# Altium schematic sheet controller.SchDoc
size Letter
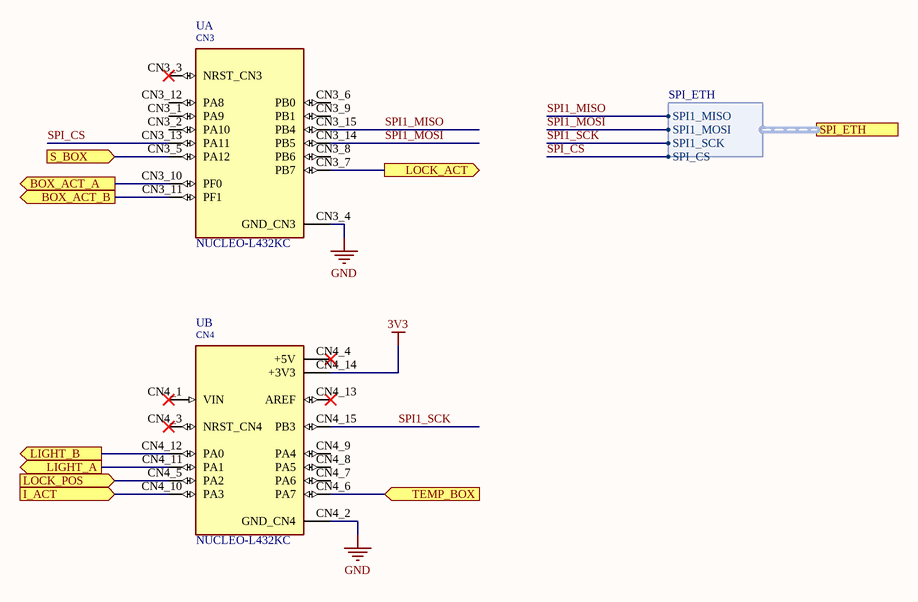
[diagram p0: controller.SchDoc]

## Parts
U  NUCLEO-L432KC  [MODULE_NUCLEO-L432KC]  (parts A,B of 2)

## Ports
BOX_ACT_A (out), BOX_ACT_B (out), I_ACT (in), LIGHT_A (out), LIGHT_B (out), LOCK_ACT (out), LOCK_POS (in), S_BOX (in), SPI_ETH (harness SPI_ETH), TEMP_BOX (in)

## Harnesses
SPI_ETH: SPI1_MISO, SPI1_MOSI, SPI1_SCK, SPI_CS

## Nets
3V3: U.CN4_14(+3V3)
GND: U.CN3_4(GND_CN3) U.CN4_2(GND_CN4)
BOX_ACT_A: U.CN3_10(PF0) ; port BOX_ACT_A
BOX_ACT_B: U.CN3_11(PF1) ; port BOX_ACT_B
I_ACT: U.CN4_10(PA3) ; port I_ACT
LIGHT_A: U.CN4_11(PA1) ; port LIGHT_A
LIGHT_B: U.CN4_12(PA0) ; port LIGHT_B
LOCK_ACT: U.CN3_7(PB7) ; port LOCK_ACT
LOCK_POS: U.CN4_5(PA2) ; port LOCK_POS
S_BOX: U.CN3_5(PA12) ; port S_BOX
SPI1_MISO: U.CN3_15(PB4) ; port SPI_ETH.SPI1_MISO
SPI1_MOSI: U.CN3_14(PB5) ; port SPI_ETH.SPI1_MOSI
SPI1_SCK: U.CN4_15(PB3) ; port SPI_ETH.SPI1_SCK
SPI_CS: U.CN3_13(PA11) ; port SPI_ETH.SPI_CS
TEMP_BOX: U.CN4_6(PA7) ; port TEMP_BOX

Not connected (* = marked no-connect by the designer): U CN3_1(PA9) CN3_2(PA10) CN3_3(NRST_CN3)* CN3_6(PB0) CN3_8(PB6) CN3_9(PB1) CN3_12(PA8) CN4_1(VIN)* CN4_3(NRST_CN4)* CN4_4(+5V)* CN4_7(PA6) CN4_8(PA5) CN4_9(PA4) CN4_13(AREF)*

## Notes on the sheet
- Title
- Size:
- Date:
- Letter
- Number:
- Time:
- Revision:
- Sheet
- of
- File:
- (in symbol NUCLEO-L432KC, part A) CN3
- (in symbol NUCLEO-L432KC, part B) CN4

## Library data of the parts
U = NUCLEO-L432KC: STM32L432KC, mbed-Enabled Development Nucleo-32 STM32L4 ARMÂ® CortexÂ®-M4 MCU 32-Bit Embedded Evaluation Board; MF: STMicroelectronics; Price: None; Value: *; Package: None; Availability: Unavailable; SnapEDA_Link: https://www.snapeda.com/parts/NUCLEO-L432KC/STMicroelectronics/view-part/628463/?ref=snap; MP: NUCLEO-L432KC